# EAGLE design RotaryEncoderBreakout (EAGLE 6.4)
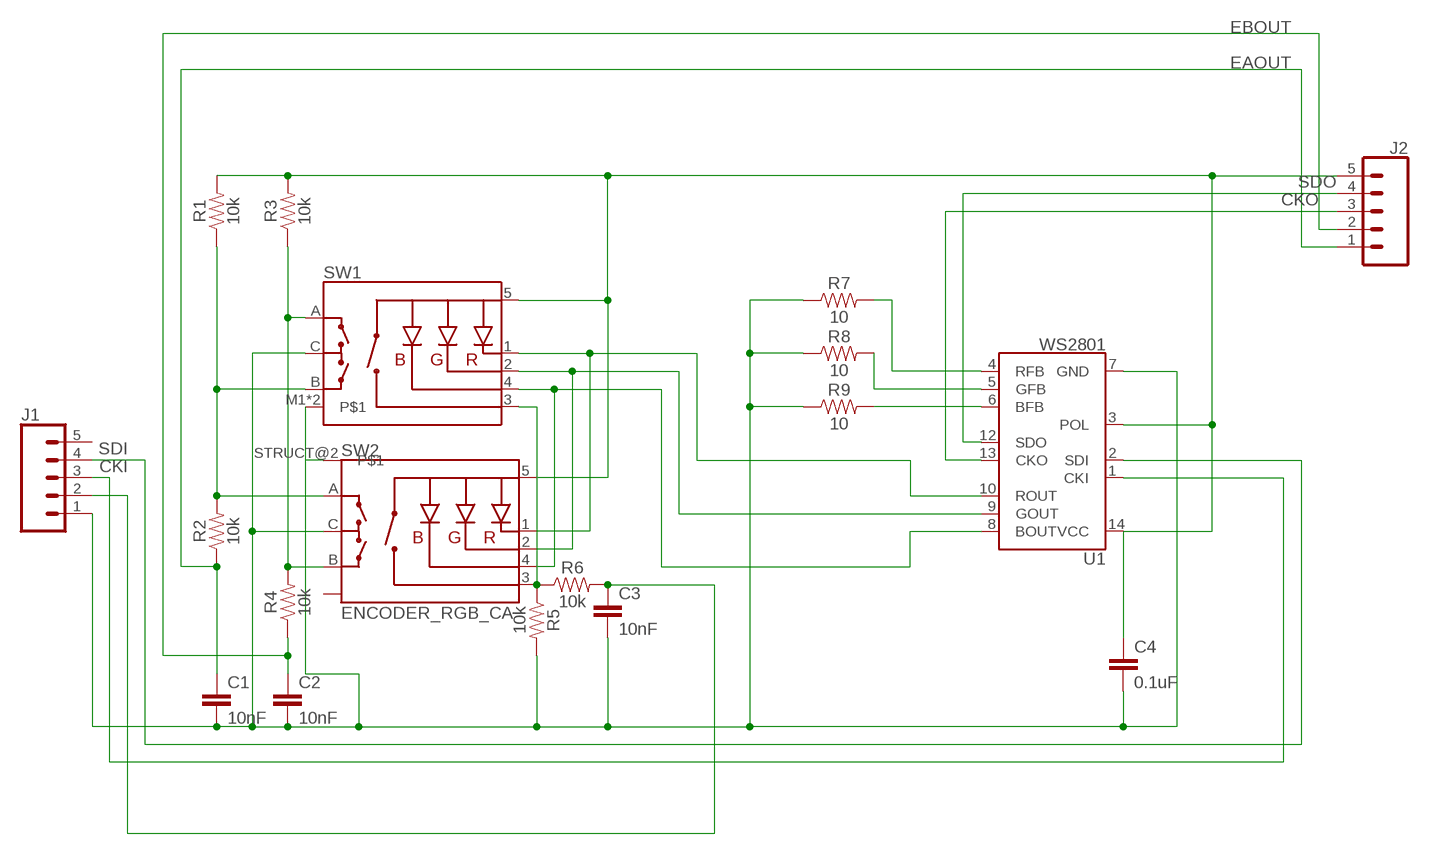
[diagram p0: schematic, sheet 1]

## Parts
C1  10nF  10NF-0603-50V-10%  [0603]
C2  10nF  10NF-0603-50V-10%  [0603]
C3  10nF  10NF-0603-50V-10%  [0603]
C4  0.1uF  0.1UF-0603-25V-(+80/-20%)  [0603]
J1  CONN_05  [1X05]
J2  CONN_05  [1X05]
R1  10k  10KOHM-0603-1/10W-1%  [0603]
R2  10k  10KOHM-0603-1/10W-1%  [0603]
R3  10k  10KOHM-0603-1/10W-1%  [0603]
R4  10k  10KOHM-0603-1/10W-1%  [0603]
R5  10k  10KOHM-0603-1/10W-1%  [0603]
R6  10k  10KOHM-0603-1/10W-1%  [0603]
R7  10  10OHM-0603-1/10W-1%  [0603]
R8  10  10OHM-0603-1/10W-1%  [0603]
R9  10  10OHM-0603-1/10W-1%  [0603]
SW1  ENCODER_RGB_CA  [ENCODER_LED_3]
SW2  ENCODER_RGB_CA  [EC12PSD-020]
U1  WS2801  [SOP-14]

## Nets
A: R1.1 R2.2 SW1.B SW2.A
B: R3.1 R4.2 SW1.A SW2.B
BFB: R9.2 U1.6(BFB)
BOUT: SW1.4(-B) SW2.4(-B) U1.8(BOUT)
CKI: J1.3 U1.1(CKI)
CKO: J2.3 U1.13(CKO)
EAOUT: C1.1 J2.1 R2.1
EBOUT: C2.1 J2.2 R4.1
GFB: R8.2 U1.5(GFB)
GND: C1.2 C2.2 C3.2 C4.2 J1.1 R5.2 R7.1 R8.1 R9.1 SW1.C SW1.M1 SW1.M2 SW2.C SW2.STRUCT@2 U1.7(GND)
GOUT: SW1.2(-G) SW2.2(-G) U1.9(GOUT)
RFB: R7.2 U1.4(RFB)
ROUT: SW1.1(-R) SW2.1(-R) U1.10(ROUT)
SDI: J1.4 U1.2(SDI)
SDO: J2.4 U1.12(SDO)
SW: R5.1 R6.2 SW1.3(SW) SW2.3(SW)
SWO: C3.1 J1.2 R6.1
VCC: C4.1 J2.5 R1.2 R3.2 SW1.5(+) SW2.5(+) U1.3(POL) U1.14(VCC)
Unconnected: J1.5 SW2.STRUCT@1(CASE)

## Library data of the parts
C1-C3 = SparkFun-Capacitors:10NF: 0.01uF/10nF/10,000pF ceramic capacitors A capacitor is a passive two-terminal electrical component used to store electrical energy temporarily in an electric field. CAP-09321; PROD_ID: CAP-00867
C4 = SparkFun-Capacitors:0.1UF: 0.1µF ceramic capacitors A capacitor is a passive two-terminal electrical component used to store electrical energy temporarily in an electric field.; PROD_ID: CAP-00810
J1 J2 = SparkFun-Connectors:CONN_05: Multi connection point. Often used as Generic Header-pin footprint for 0.1 inch spaced/style header connections On any of the 0.1 inch spaced packages, you can populate with these: Break Away Headers - Straight <https://www.sparkfun.com/products/116> (PRT-00116) Break Away Male Headers - Right Angle <https://www.sparkfun.com/products/553> (PRT-00553) Female Headers <https://www.sparkfun.com/products/115> (PRT-00115) Break Away Headers - Machine Pin <https://www.sparkfun.com/products/117> (PRT-00117) Break Away Female Headers - Swiss Machine Pin <https://www.sparkfun.com/products/743> (PRT-00743) For SCREWTERMINALS and SPRING TERMINALS visit here: Screw Terimnals on SparkFun.com <https://www.sparkfun.com/search/results?term=Screw+Terminals> (5mm/3.5mm/2.54mm spacing) This device is also useful as a general connection point to wire up your design to another part of your project. Our various solder wires solder well into these plated through hole pads. Hook-Up Wire - Assortment (Stranded, 22 AWG) <https://www.sparkfun.com/products/11375> (PRT-11375) Hook-Up Wire - Assortment (Solid Core, 22 AWG) <https://www.sparkfun.com/products/11367> (PRT-11367) View the entire wire category on our website here <https://www.sparkfun.com/categories/141> Special notes: Molex polarized connector foot print use with SKU : PRT-08231 with associated crimp pins and housings. 1MM SMD Version SKU: PRT-10208
R1-R6 = SparkFun-Resistors:10KOHM: 10kΩ resistor A resistor is a passive two-terminal electrical component that implements electrical resistance as a circuit element. Resistors act to reduce current flow, and, at the same time, act to lower voltage levels within circuits. - Wikipedia; PROD_ID: RES-00824
R7-R9 = SparkFun-Resistors:10OHM: 10Ω resistor A resistor is a passive two-terminal electrical component that implements electrical resistance as a circuit element. Resistors act to reduce current flow, and, at the same time, act to lower voltage levels within circuits. - Wikipedia; PROD_ID: RES-12581
SW1 = SparkFun-Electromechanical:ENCODER_RGB_CA: Illuminated Rotary Encoder w/ RGB LED and select switch EC12PLRGBSDVBF-D: http://top-up.so-buy.com/front/bin/ptdetail.phtml?Part=EC12PLRGBSDVBF-D
SW2 = COM-10984:ENCODER_RGB_CA: Illuminated Rotary Encoder w/ CA RGB LED and select switch
U1 = SparkFun-Retired:WS2801: WS2801 3 Channel Constant Current LED Driver with programmable PWM outputs. Datasheet: http://www.sparkfun.com/datasheets/Components/LED/WS2801.pdf RETIRED: IC-10297 (also, wrong cat)

## Board
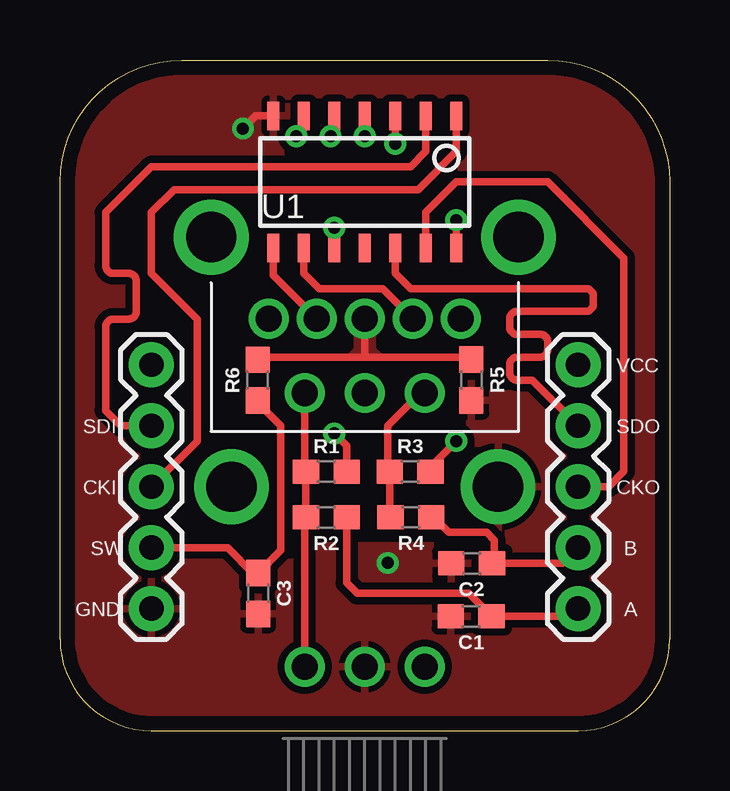
[diagram p1: board, top side]
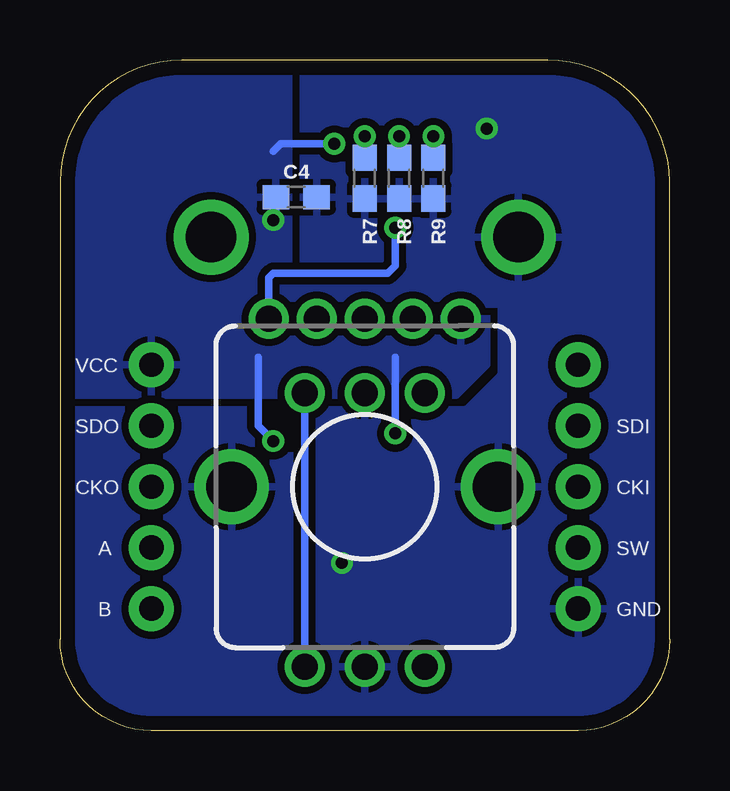
[diagram p2: board, bottom side, seen from below]

Size 25.4 x 27.94 mm. Coordinates in mm from the lower left corner, seen from the top.
Outline: 0,3.81 0,22.86 arc-90 5.08,27.94 20.32,27.94 arc-90 25.4,22.86 25.4,3.81 arc-90 21.59,0 3.81,0 arc-90 0,3.81
Copper layers (1*16): Top 0.035mm / dielectric 1.5mm / Bottom 0.035mm
Design rules "default *": minimum track width 10mil, minimum drill 0.5mm, track to track 12mil, track to pad 8mil, pad to pad 8mil, via to via 8mil, smd to smd 8mil, copper to edge 24mil, drill to drill 8mil, minimum pad ring 10mil, minimum via ring 8mil, stop-mask expansion 4mil, vias tented up to drill 20mil, thermal gap 10mil
tRestrict: area 10.2,7.6 to 16.5,15.2; area 17.8,14.6 to 20.3,17.8; area 3.8,7.6 to 8.9,20.3

### Footprints (pad centres in the part's own frame; a part is rotated, then mirrored left to right if it is on the bottom)
0603 = smd 1.1 x 1: 1 -0.85,0; 2 0.85,0
1X05 = drill 1.016 pad 1.88: 1 0,0; 2 2.54,0; 3 5.08,0; 4 7.62,0; 5 10.16,0
ENCODER_LED_3 = drill 1.1: 1 -4,7; 2 -2,7; 3 0,7; 4 2,7; 5 4,7; A -2.5,-7.5; B 2.5,-7.5; C 0,-7.5 | drill 2.1: M1 -5.55,0; M2 5.55,0
EC12PSD-020 = drill 1.1: 1 -7,4; 2 -7,2; 3 -7,0; 4 -7,-2; 5 -7,-4; A -3.9,-2.5; B -3.9,2.5; C -3.9,0 | drill 2.1: STRUCT@1 -10.4,6.4; STRUCT@2 -10.4,-6.4
SOP-14 = smd 0.5 x 1.2: 1 -3.81,-2.75; 2 -2.54,-2.75; 3 -1.27,-2.75; 4 0,-2.75; 5 1.27,-2.75; 6 2.54,-2.75; 7 3.81,-2.75; 8 3.81,2.75; 9 2.54,2.75; 10 1.27,2.75; 11 0,2.75; 12 -1.27,2.75; 13 -2.54,2.75; 14 -3.81,2.75

### Placement (x,y rotation side)
C1  17.13,4.76 180 top
C2  17.15,6.97 180 top
C3  8.26,5.71 270 top
C4  15.56,22.23 0 bottom
J1  3.81,5.08 90 top
J2  21.59,5.08 90 top
R1  11.1,10.79 0 top
R2  11.1,8.88 180 top
R3  14.59,10.79 0 top
R4  14.62,8.89 180 top
R5  17.14,14.61 270 top
R6  8.24,14.6 90 top
R7  12.7,23.02 90 bottom
R8  11.27,23.02 90 bottom
R9  9.84,23.02 90 bottom
SW1  12.7,10.16 0 bottom
SW2  12.7,10.16 270 top
U1  12.7,22.86 180 top

### Tracks (layer width: path | path; a pad name or v marks a point on that pad's centre or on a via)
A
  Top 0.305: SW2.A 10.2,11.06 R1.1 R2.2 10.2,8.84 SW1.B
B
  Top 0.305: SW2.B 15.01,14.06 13.65,12.7 13.65,10.88 R3.1 13.74,8.93 R4.2
  Bottom 0.305: SW1.A 15.2,13.93 15.24,13.97 15.24,14.02 SW2.B
BFB  (via drill 0.5)
  Top 0.305: U1.6 10.16,25.08 v9.84,24.77
  Bottom 0.305: v9.84,24.77 R9.2
BOUT
  Top 0.305: U1.8 8.89,18.97 SW2.4
CKI
  Top 0.305: U1.1 16.51,24.13 14.92,22.54 4.76,22.54 3.81,21.59 3.81,19.05 5.71,17.14 5.71,12.06 J1.3
CKO
  Top 0.305: U1.13 15.24,21.59 16.51,22.86 20.32,22.86 23.5,19.68 23.5,10.79 22.86,10.16 J2.3
EAOUT
  Top 0.305: R2.1 11.95,6.15 12.38,5.71 17.02,5.71 C1.1 21.27,4.76 J2.1
EBOUT
  Top 0.305: R4.1 15.55,8.89 16.19,8.26 17.78,8.26 18.1,7.94 18.1,7.07 C2.1 20.94,6.97 J2.2
GFB  (via drill 0.5)
  Top 0.305: U1.5 11.43,24.92 v11.27,24.77
  Bottom 0.305: v11.27,24.77 R8.2
GND  (via drill 0.5)
  Top 0.305: 4.03,4.87 J1.1 | U1.7 8.15,25.61 v7.62,25.08 | R5.2 17.36,13.76
  Bottom 0.305: 9.55,21.88 R9.1 | 14.45,22.17 C4.2
  other vias: 13.65,6.99
  pour Bottom (isolate 0.254, rank 2): 0,27.94 25.4,27.94 25.4,0 0,0
  pour Top (isolate 0.254, rank 2): 0,27.94 25.4,27.94 25.4,0 0,0
GOUT
  Top 0.305: U1.9 10.16,19.05 10.79,18.41 13.45,18.41 SW2.2
RFB  (via drill 0.5)
  Top 0.305: U1.4 v12.7,24.77
  Bottom 0.305: v12.7,24.77 R7.2
ROUT  (via drill 0.5)
  Top 0.305: v11.43,20.95 U1.10
  Bottom 0.305: SW2.1 16.7,18.86 16.51,19.05 11.75,19.05 11.43,19.37 v11.43,20.95
SDI
  Top 0.305: U1.2 15.24,24.13 14.61,23.5 3.81,23.5 1.91,21.59 1.91,19.37 arc90 2.22,19.05 2.86,19.05 arc-90 3.17,18.73 3.17,17.46 arc-90 2.86,17.14 2.22,17.14 arc90 1.91,16.83 1.91,13.34 2.54,12.7 J1.4
SDO
  Top 0.305: U1.12 13.97,19.05 14.61,18.41 21.91,18.41 arc-90 22.23,18.1 22.23,17.78 arc-90 21.91,17.46 19.05,17.46 arc90 18.73,17.14 18.73,16.83 arc90 19.05,16.51 20,16.51 arc-90 20.32,16.19 20.32,15.88 arc-90 20,15.56 19.05,15.56 arc90 18.73,15.24 18.73,14.92 arc90 19.05,14.61 19.68,14.61 J2.4
SW
  Top 0.305: SW2.3 12.7,15.56 | 12.7,15.56 17.04,15.56 R5.1 | R6.2 8.46,15.45 8.57,15.56 12.7,15.56
  pour Top (no thermals): 12.38,15.56 12.06,15.56 12.38,15.88 12.38,16.51 13.02,16.51 13.02,15.88 13.34,15.56
SWO
  Top 0.305: R6.1 8.24,13.67 9.21,12.7 9.21,7.52 C3.1 8.04,6.57 6.99,7.62 J1.2
VCC  (via drill 0.5)
  Top 0.305: U1.3 v13.97,24.45 | R3.2 15.44,10.99 v16.51,12.06 | R1.2 11.95,11.87 v11.43,12.38 | v16.51,21.27 U1.14
  Bottom 0.305: v16.51,12.06 17.14,12.7 17.14,15.56 | v16.51,21.27 16.41,21.06 C4.1 16.51,21.91 | v11.43,12.38 11.43,15.56 | v13.97,24.45 16.19,24.45 16.51,24.13
  pour Bottom (isolate 0.305): 25.4,13.97 8.89,13.97 7.62,15.24 7.62,17.78 10.16,17.78 11.43,19.05 15.88,19.05 15.88,27.94 25.4,27.94

### Text on the board
tNames: VCC | SDI | SDO | CKI | CKO | SW | B | GND | A
bNames: VCC | SDI | SDO | CKI | CKO | SW | A | GND | B